# EAGLE design EspProgrammer (EAGLE 9.6.2)
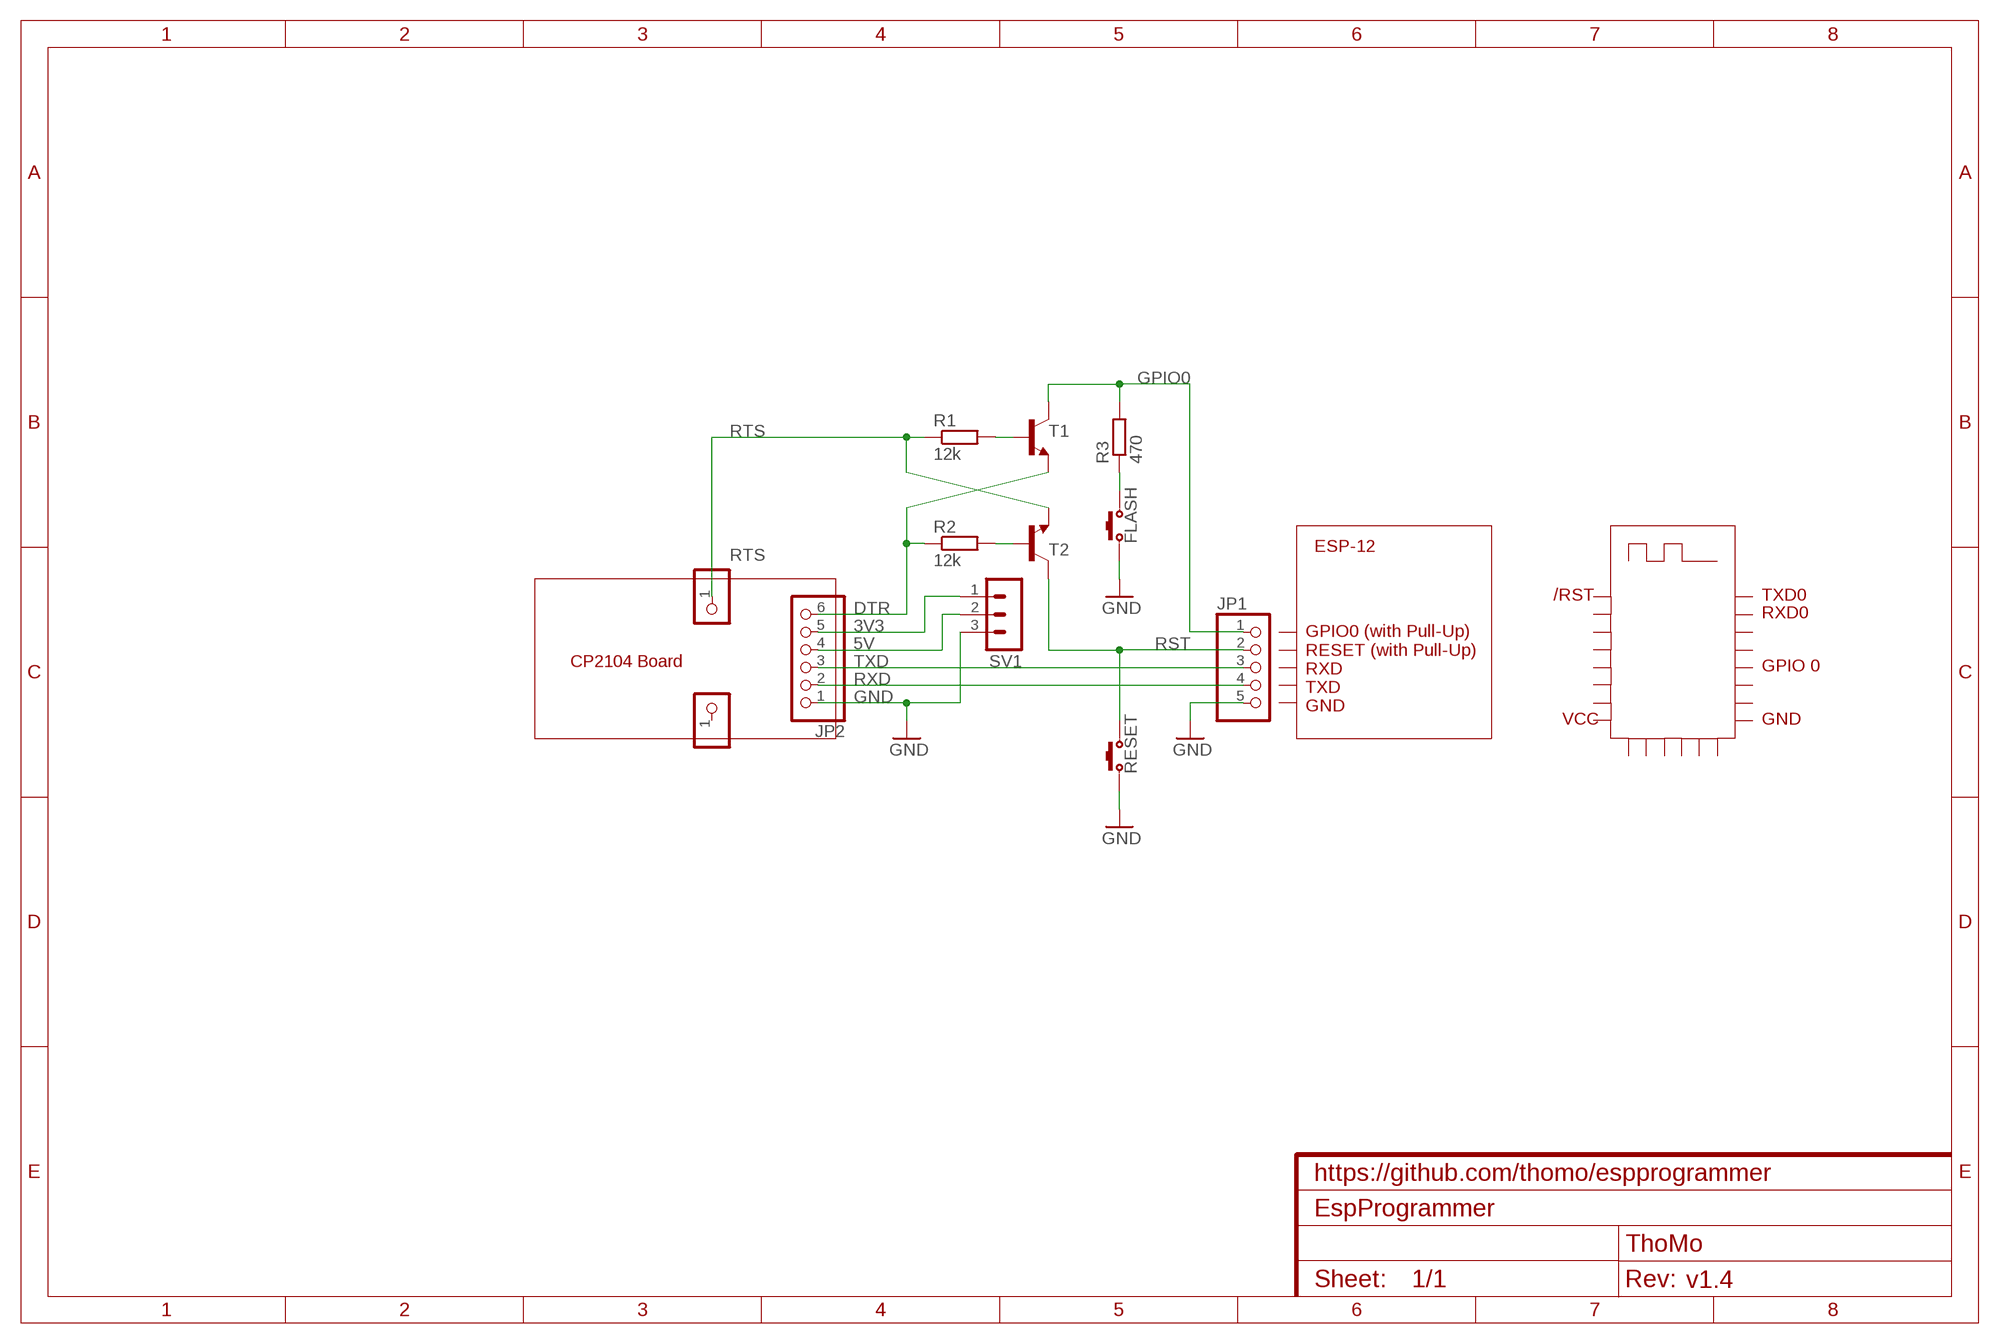
[diagram p0: schematic, sheet 1]
FRAME2 (FRAME-A4L): CNAME: https://github.com/thomo/espprogrammer; CREVISION: v1.4; DESIGNER: ThoMo

## Parts
FLASH  KEY  [SMD-BUTTON]
JP1  PINHD-1X5/90  [1X05/90]
JP2  PINHD-1X6  [1X06]
LSP2  PINHD-1X1  [1X01]
LSP3  PINHD-1X1  [1X01]
R1  12k  R-EU_R1206  [R1206]
R2  12k  R-EU_R1206  [R1206]
R3  470  R-EU_R1206  [R1206]
RESET  KEY  [SMD-BUTTON]
SV1  MA03-1  [MA03-1]
T1  BC817-40LT1SMD  [SOT23-BEC]
T2  BC817-40LT1SMD  [SOT23-BEC]

## Nets
3V3: JP2.5 SV1.1
5V: JP2.4 SV1.2
DTR: JP2.6 R2.1 T1.E
GND: FLASH.2 JP1.5 JP2.1 RESET.2 SV1.3
GPIO0: JP1.1 R3.2 T1.C
N$1: R1.2 T1.B
N$2: R2.2 T2.B
N$3: FLASH.1 R3.1
RST: JP1.2 RESET.1 T2.C
RTS: LSP3.1 R1.1 T2.E
RXD: JP1.4 JP2.2
TXD: JP1.3 JP2.3
Unconnected: LSP2.1

## Notes on the sheet
- ESP-12
- /RST | TXD0
- RXD0
- CP2104 Board | GPIO 0
- GPIO0 (with Pull-Up)
  RESET (with Pull-Up)
  RXD
  TXD
  GND
- VCC | GND

## Library data of the parts
FLASH RESET = thomo:KEY
JP1 = pinhead:PINHD-1X5: PIN HEADER
JP2 = pinhead:PINHD-1X6: PIN HEADER
LSP2 LSP3 = pinhead:PINHD-1X1: PIN HEADER
R1-R3 = rcl:R-EU_: RESISTOR, European symbol; SPICEPREFIX: R
SV1 = con-lstb:MA03-1: PIN HEADER; OC_FARNELL: unknown; OC_NEWARK: unknown
T1 T2 = transistor-npn:BC817*: NPN Transistor

## Board
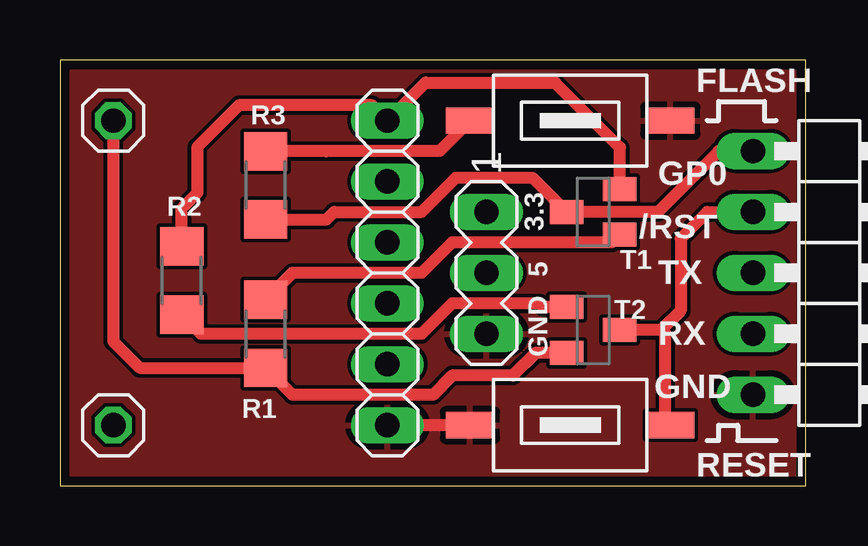
[diagram p1: board, top side]
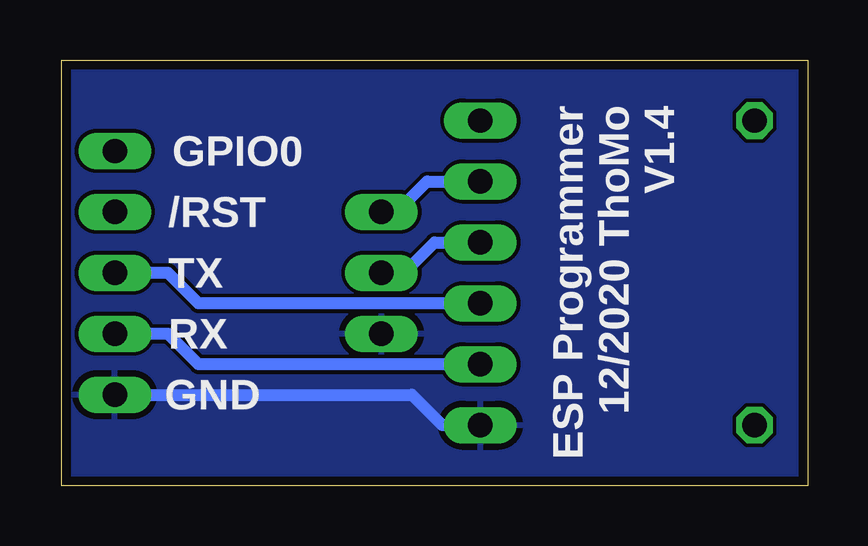
[diagram p2: board, bottom side, seen from below]

Size 31.1 x 17.77 mm. Coordinates in mm from the lower left corner, seen from the top.
Outline: 0,0 31.1,0 31.1,17.77 0,17.77 0,0
Copper layers (1*16): Top 0.035559375mm / dielectric 1.6mm / Bottom 0.035559375mm
Design rules "oshpark-2layer": minimum track width 6mil, minimum drill 10mil, track to track 6mil, track to pad 6mil, pad to pad 6mil, via to via 6mil, smd to smd 6mil, copper to edge 15mil, drill to drill 6mil, minimum pad ring 5mil, minimum via ring 5mil, stop-mask expansion 2.5mil, vias tented up to drill 0mil, thermal gap 10mil

### Footprints (pad centres in the part's own frame; a part is rotated, then mirrored left to right if it is on the bottom)
SMD-BUTTON = smd 1.092 x 2.007: 1 0,-4.178; 2 0,4.178
1X05/90 = drill 1.016 long: 1 -5.08,-3.81; 2 -2.54,-3.81; 3 0,-3.81; 4 2.54,-3.81; 5 5.08,-3.81
1X06 = drill 1.016 long: 1 -6.35,0; 2 -3.81,0; 3 -1.27,0; 4 1.27,0; 5 3.81,0; 6 6.35,0
1X01 = drill 1.016 octagon: 1 0,0
R1206 = smd 1.6 x 1.803: 1 -1.422,0; 2 1.422,0
MA03-1 = drill 1.016 long: 1 -2.54,0; 2 0,0; 3 2.54,0
SOT23-BEC = smd 1 x 1.4: B -0.95,-1.1; C 0,1.1; E 0.95,-1.1

### Placement (x,y rotation side)
FLASH  21.27,15.24 270 top
JP1  32.7,8.89 270 top
JP2  13.65,8.89 90 top
LSP2  2.22,2.54 0 top
LSP3  2.22,15.24 0 top
R1  8.57,6.35 90 top
R2  5.08,8.57 270 top
R3  8.57,12.54 270 top
RESET  21.27,2.54 90 top
SV1  17.78,8.89 270 top
T1  22.23,11.43 90 top
T2  22.23,6.51 270 top

### Tracks (layer width: path | path; a pad name or v marks a point on that pad's centre or on a via)
3V3
  Bottom 0.508: JP2.5 15.88,12.7 17.14,11.43 SV1.1
5V
  Bottom 0.508: SV1.2 16.83,8.89 15.56,10.16 JP2.4
DTR
  Top 0.508: R2.1 5.08,11.58 5.72,12.22 5.72,14.13 7.47,15.88 13.02,15.88 JP2.6 15.24,16.83 20.64,16.83 23.35,14.12 23.35,12.4 T1.E
GND
  Top 0.508: RESET.2 JP2.1
  Bottom 0.508: JP2.1 15.24,2.54 16.51,3.81 JP1.5
  pour Bottom: 0,17.78 0,0 31.11,0 31.11,17.78
  pour Top: 31.11,17.78 0,17.78 0,0 31.11,0
GPIO0
  Top 0.508: JP1.1 27.46,13.97 24.92,11.43 T1.C 19.7,12.86 16.51,12.86 15.08,11.43 11.43,11.43 11.12,11.12 R3.2
N$1
  Top 0.508: T1.B 23,10.16 16.35,10.16 15.08,8.89 9.69,8.89 R1.2
N$2
  Top 0.508: T2.B 20.16,7.46 20,7.62 16.35,7.62 15.08,6.35 5.88,6.35 R2.2
N$3
  Top 0.508: FLASH.1 15.82,13.97 11.11,13.97 11.11,13.96 R3.1
RST
  Top 0.406: RESET.1 25.24,2.75
  Top 0.508: JP1.2 26.99,11.43 25.88,10.32 25.88,7.3 25.08,6.51 | 25.08,6.51 T2.C | 25.08,6.51 25.24,6.35 25.24,2.75
RTS
  Top 0.508: LSP3.1 2.22,6.03 3.33,4.93 R1.1 9.69,3.81 15.56,3.81 16.35,4.6 18.89,4.6 19.85,5.56 T2.E
RXD
  Bottom 0.508: JP2.2 25.4,5.08 26.67,6.35 JP1.4
TXD
  Bottom 0.508: JP2.3 25.4,7.62 26.67,8.89 JP1.3

### Text on the board
bPlace: GPIO0 | /RST | TX | RX | GND
tNames: GP0 | 3.3 | /RST | 5 | TX | RX | GND | GND
bNames: ESP Programmer / 12/2020 ThoMo / V1.4